# Altium schematic sheet 28 Core Pwr.SchDoc
size 420 x 297 mm
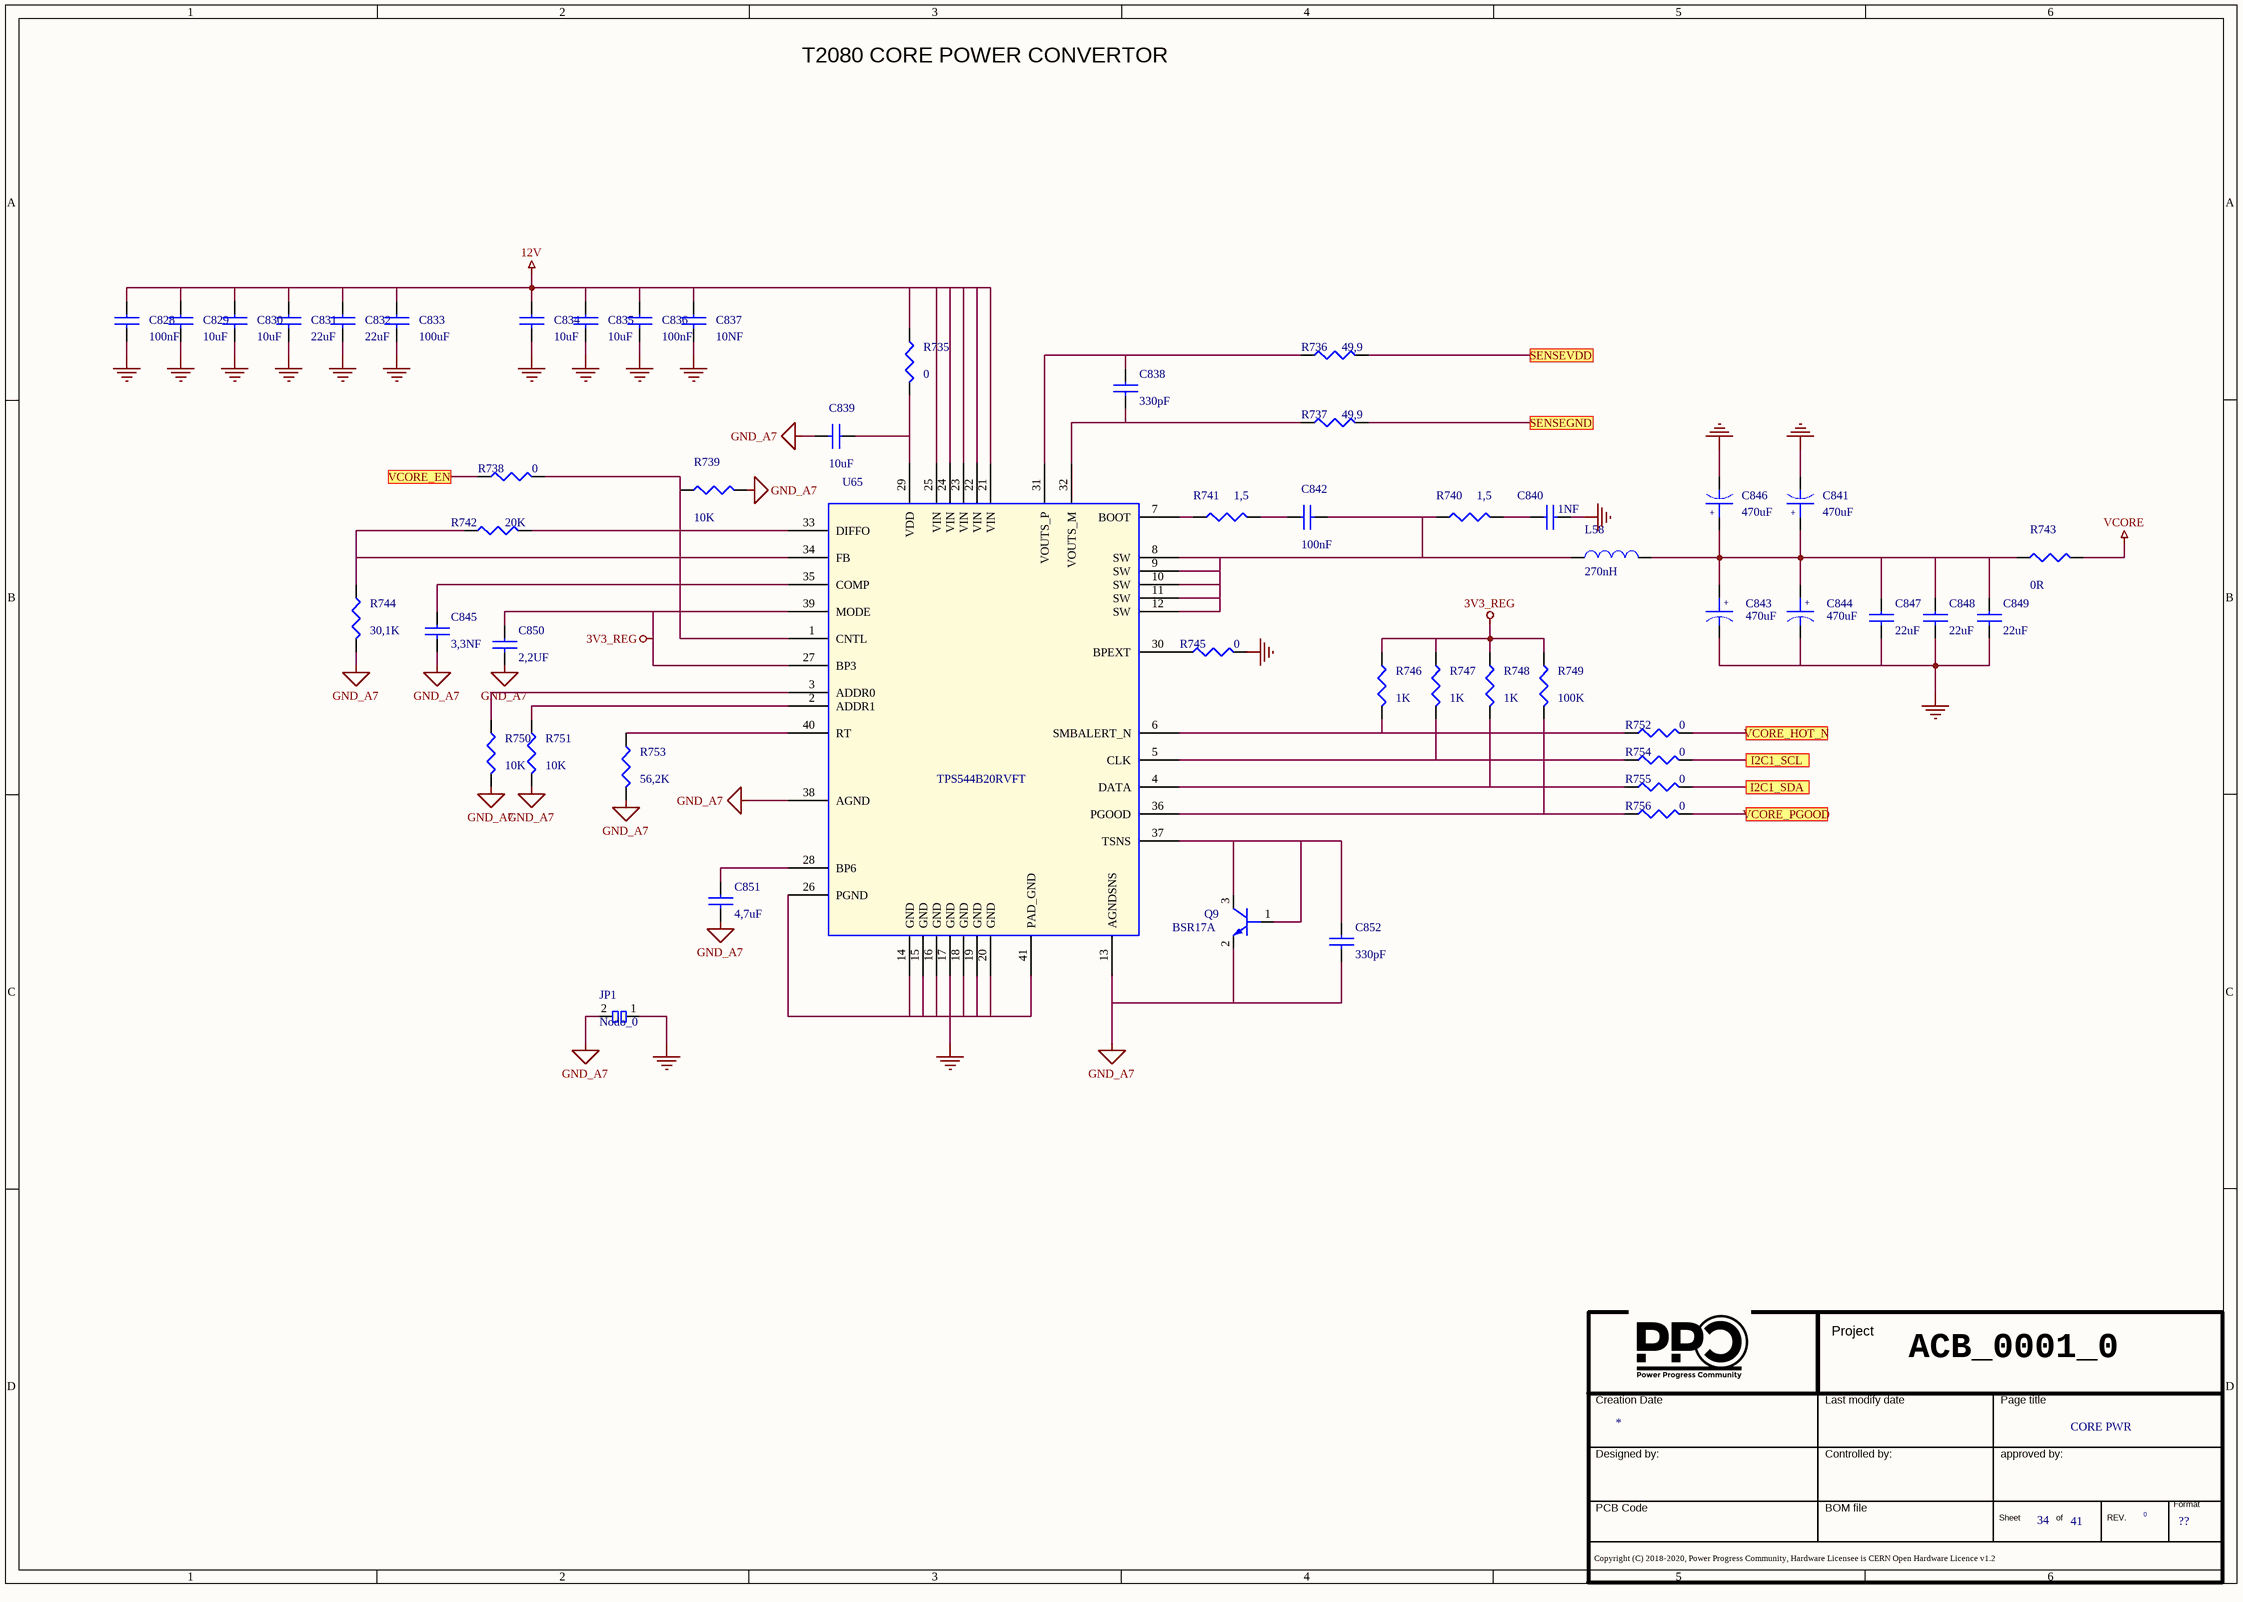
[diagram p0: 28 Core Pwr.SchDoc]

## Parts
*  Doc: CORE PWR  Page Count: 41  Page Number: 34  Page Size: ??  RevCode: 0  (hidden comment: Title_block_PPC)  (graphical)
C828  100nF  [SMD_0402]
C829  10uF  [SMD_0603]
C830  10uF  [SMD_0603]
C831  22uF  [SMD_0805]
C832  22uF  [SMD_0805]
C833  100uF  [SMD_1210]
C834  10uF  [SMD_0603]
C835  10uF  [SMD_0603]
C836  100nF  [SMD_0402]
C837  10NF  [SMD_0402]
C838  330pF  [SMD_0402]
C839  10uF  [SMD_0603]
C840  1NF  [SMD_0402]
C841  470uF  [SMD_CASE_GX]
C842  100nF  [SMD_0402]
C843  470uF  [SMD_CASE_GX]
C844  470uF  [SMD_CASE_GX]
C845  3,3NF  [SMD_0402]
C846  470uF  [SMD_CASE_GX]
C847  22uF  [SMD_1206]
C848  22uF  [SMD_1206]
C849  22uF  [SMD_1206]
C850  2,2UF  [SMD_0402]
C851  4,7uF  [SMD_0402]
C852  330pF  [SMD_0402]
JP1  Nodo_0
L58  270nH  [SMD_7_65X11mm]
Q9  BSR17A  [SOT_23]
R735  0  [SMD_1206]
R736  49,9  [SMD_0402]
R737  49,9  [SMD_0402]
R738  0  [SMD_0402]
R739  10K  [SMD_0402]
R740  1,5  [SMD_0402]
R741  1,5  [SMD_0402]
R742  20K  [SMD_0402]
R743  0R  [SMD_2010]
R744  30,1K  [SMD_0402]
R745  0  [SMD_0402]
R746  1K  [SMD_0402]
R747  1K  [SMD_0402]
R748  1K  [SMD_0402]
R749  100K  [SMD_0402]
R750  10K  [SMD_0402]
R751  10K  [SMD_0402]
R752  0  [SMD_0402]
R753  56,2K  [SMD_0402]
R754  0  [SMD_0402]
R755  0  [SMD_0402]
R756  0  [SMD_0402]
U65  TPS544B20RVFT  [LQFN40]

## Ports
I2C1_SCL, I2C1_SDA, SENSEGND, SENSEVDD, VCORE_EN, VCORE_HOT_N, VCORE_PGOOD

## Nets
3V3_REG: C850.1 R746.1 R747.1 R748.1 R749.1 U65.27(BP3) U65.39(MODE)
12V: C828.1 C829.1 C830.1 C831.1 C832.1 C833.1 C834.1 C835.1 C836.1 C837.1 R735.1 U65.21(VIN) U65.22(VIN) U65.23(VIN) U65.24(VIN) U65.25(VIN)
GND: C828.2 C829.2 C830.2 C831.2 C832.2 C833.2 C834.2 C835.2 C836.2 C837.2 C840.2 C841.2 C843.2 C844.2 C846.2 C847.2 C848.2 C849.2 JP1.1 R745.2 U65.14(GND) U65.15(GND) U65.16(GND) U65.17(GND) U65.18(GND) U65.19(GND) U65.20(GND) U65.26(PGND) U65.41(PAD_GND)
GND_A7: C839.2 C845.2 C850.2 C851.2 C852.2 JP1.2 Q9.2(E) R739.2 R744.2 R750.2 R751.2 R753.2 U65.13(AGNDSNS) U65.38(AGND)
VCORE: R743.2
I2C1_SCL: R754.2 ; port I2C1_SCL
I2C1_SDA: R755.2 ; port I2C1_SDA
SENSEGND: R737.2 ; port SENSEGND
SENSEVDD: R736.2 ; port SENSEVDD
VCORE_EN: R738.1 ; port VCORE_EN
VCORE_HOT_N: R752.2 ; port VCORE_HOT_N
VCORE_PGOOD: R756.2 ; port VCORE_PGOOD
NetC838_1: C838.1 R736.1 U65.31(VOUTS_P)
NetC838_2: C838.2 R737.1 U65.32(VOUTS_M)
NetC839_1: C839.1 R735.2 U65.29(VDD)
NetC840_1: C840.1 R740.2
NetC841_1: C841.1 C843.1 C844.1 C846.1 C847.1 C848.1 C849.1 L58.2 R743.1
NetC842_1: C842.1 R741.2
NetC842_2: C842.2 L58.1 R740.1 U65.8(SW) U65.9(SW) U65.10(SW) U65.11(SW) U65.12(SW)
NetC845_1: C845.1 U65.35(COMP)
NetC851_1: C851.1 U65.28(BP6)
NetC852_1: C852.1 Q9.1(B) Q9.3(C) U65.37(TSNS)
NetR738_2: R738.2 R739.1 U65.1(CNTL)
NetR741_1: R741.1 U65.7(BOOT)
NetR742_1: R742.1 R744.1 U65.34(FB)
NetR742_2: R742.2 U65.33(DIFFO)
NetR745_1: R745.1 U65.30(BPEXT)
NetR746_2: R746.2 R752.1 U65.6(SMBALERT_N)
NetR747_2: R747.2 R754.1 U65.5(CLK)
NetR748_2: R748.2 R755.1 U65.4(DATA)
NetR749_2: R749.2 R756.1 U65.36(PGOOD)
NetR750_1: R750.1 U65.3(ADDR0)
NetR751_1: R751.1 U65.2(ADDR1)
NetR753_1: R753.1 U65.40(RT)

## Notes on the sheet
- T2080 CORE POWER CONVERTOR
- ACB_0001_0
- (in symbol CAP POL) +
- (in symbol Title_block_PPC) Project; Creation Date; Last modify date; Page title; Designed by:; Controlled by:; approved by:; Format; PCB Code; BOM file; Sheet; of; REV.; Copyright (C) 2018-2020, Power Progress Community, Hardware Licensee is CERN Open Hardware Licence v1.2

## Library data of the parts
* = Title_block_PPC: Title: T2080PCIe; Schematic Page Count: 45; Schematic Page Number: 37; Author: MICETEK; Page Create Date: March  8, 1995; Page Title: ?; Page Modify Date: *
C828 C836 = CAP NP_Dup2: COND.CER. 100NF 50V 0402 X7R SMD; Manufacturer Part Number 1: CGA2B3X7R1H104M050BD; Manufacturer 1: TDK; Part Number: PASSIVE_24; RSM: RC0402; PCB Footprint: SMD_0402; Part Type: Capacitors\Ceramic\SMD\0402
C829 C830 C834 C835 C839 = CAP NP_Dup2: COND.CER.10uF 0603 25V SMD; Part Number: PASSIVE_124; Manufacturer 1: SAMSUNG; Manufacturer Part Number 1: CL10A106MA8NRNC; RSM: RC0603; PCB Footprint: SMD_0603; Part Type: Capacitors\Ceramic\SMD\0603
C831 C832 = CAP NP_Dup2: 22UF 35V 20% 0805; Part Number: PASSIVE_224; Manufacturer 1: TDK; Manufacturer Part Number 1: C2012X5R1V226M125AC; RSM: RC0805; PCB Footprint: SMD_0805; Part Type: Capacitors\Ceramic\SMD\0805
C833 = CAP NP_Dup2: CAP CER 100UF 16V 20% X5R 1210; Part Number: PASSIVE_264; Manufacturer 1: Taiyo Yuden; Manufacturer Part Number 1: EMK325ABJ107MM-T; RSM: RC1210; PCB Footprint: SMD_1210; Part Type: Capacitors\Ceramic\SMD\1210
C837 = CAP NP_Dup2: COND.CER. 10NF 16V 0402 X7R SMD; Manufacturer Part Number 1: 0402YC103KAT2A; Manufacturer 1: AVX; Part Number: PASSIVE_28; RSM: RC0402; PCB Footprint: SMD_0402; Part Type: Capacitors\Ceramic\SMD\0402
C838 C852 = CAP NP_Dup2: CAP CER 330PF 50V 5% C0G 0402 HiRel; Manufacturer Part Number 1: CGJ2B2C0G1H331J050BA; Manufacturer 1: TDK; Part Number: PASSIVE_73; RSM: RC0402; PCB Footprint: SMD_0402; Part Type: Capacitors\Ceramic\SMD\0402
C840 = CAP NP_Dup2: COND.CER. 1NF 50V 0402 X7R SMD; Manufacturer Part Number 1: GRM15XR71H102KA86D; Manufacturer 1: Murata; Part Number: PASSIVE_47; RSM: RC0402; PCB Footprint: SMD_0402; Part Type: Capacitors\Ceramic\SMD\0402
C841 C846 = CAP POL: COND.TANT. 470uF 2v CASE-GX SMD; Part Number: PASSIVE_1473; Manufacturer 1: PANASONIC; Manufacturer Part Number 1: EEF-GX0D471R; RSM: TANT-D; PCB Footprint: SMD_CASE_GX; Part Type: Capacitors\Tantalum\SMD\CASE_GX
C842 = CAP NP_Dup2: COND.CER. 100NF 50V 0402 X7R SMD; Part Number: PASSIVE_24; Manufacturer 1: TDK; Manufacturer Part Number 1: CGA2B3X7R1H104M050BD; RSM: RC0402; PCB Footprint: SMD_0402; Part Type: Capacitors\Ceramic\SMD\0402
C843 C844 = CAP POL: COND.TANT. 470uF 2v CASE-GX SMD; Manufacturer Part Number 1: EEF-GX0D471R; Manufacturer 1: PANASONIC; Part Number: PASSIVE_1473; RSM: TANT-D; PCB Footprint: SMD_CASE_GX; Part Type: Capacitors\Tantalum\SMD\CASE_GX
C845 = CAP NP_Dup2: COND.CER. 3,3NF 50V 0402 X7R SMD; Part Number: PASSIVE_69; RSM: RC0402; PCB Footprint: SMD_0402; Part Type: Capacitors\Ceramic\SMD\0402
C847-C849 = CAP NP_Dup2: CAP CER 22UF 16V 10% X5R 1206; Manufacturer Part Number 1: CL31A226KOHNNNE; Manufacturer 1: SAMSUNG; Part Number: PASSIVE_258; RSM: RC1206; PCB Footprint: SMD_1206; Part Type: Capacitors\Ceramic\SMD\1206
C850 = CAP NP_Dup2: CAP CER 2.2UF 25V X5R 0402; Manufacturer Part Number 1: GRM155R61E225ME15D; Manufacturer 1: Murata; Part Number: PASSIVE_1411; RSM: RC0402; PCB Footprint: SMD_0402; Part Type: Capacitors\Ceramic\SMD\0402
C851 = CAP NP_Dup2: CAP CER 4.7UF 10V 20% X5R 0402; Part Number: PASSIVE_80; Manufacturer 1: TDK; Manufacturer Part Number 1: C1005X5R1A475M050BC; RSM: RC0402; PCB Footprint: SMD_0402; Part Type: Capacitors\Ceramic\SMD\0402
JP1 = JUMPER_0: Serve solo al masterista per collegare i gnd; LNK_PART: SEZ0201_CHIUSO; Part Number: DA CODIFICARE; TECNO77: NODO; Part Type: NODO; RSM: NODO
L58 = INDUCTOR_Dup1: Induttori fissi 270nH Shld 20% 35.5A 228mOhms; Manufacturer Part Number 1: SLC1175-271MEB; Manufacturer 1: Coilcraft; Part Number: PASSIVE_1472; RSM: IND-BOURNS-SLC1175; PCB Footprint: SMD_7_65X11mm; Part Type: Inductors\SMD
Q9 = NPN BEC: TRANS NPN 40V 0.2A SOT-23; Manufacturer 1: ON Semi; Part Number: DISCRETE_327; PCB Footprint: SOT_23; Distributor 1: DIGIKEY ( / DIGIKEY(BSR17ATR-ND); Manufacturer Part Number 1: BSR17A; Part Type: Transistors\Bipolar\NPN; RSM: SOT-23
R735 = R_Dup5: RESIS. 0R 1/4W 1206 SMD E96; Manufacturer Part Number 1: RC1206JR-070RL; Manufacturer 1: YAGEO; Part Number: PASSIVE_1266; RSM: RC1206; PCB Footprint: SMD_1206; Part Type: Resistors\Fixed\SMD\1206\5%
R736 R737 = R_Dup5: RESIS.CHIP 49,9R 1% 0402 SMD; Part Number: PASSIVE_738; Manufacturer 1: NIC; Manufacturer Part Number 1: NCR04F49R9TRF; RSM: RC0402; PCB Footprint: SMD_0402; Part Type: Resistors\Fixed\SMD\0402\1%
R738 R745 R752 R754-R756 = R_Dup5: RESIS.CHIP 0R 5% 0402 SMD; Part Number: PASSIVE_805; Manufacturer 1: ROYAL OHM; RSM: RC0402; PCB Footprint: SMD_0402; Part Type: Resistors\Fixed\SMD\0402\5%; Manufacturer Part Number 1: RESIS.CHIP 0R 5% 0402 SMD
R739 R750 R751 = R_Dup5: RESIS.CHIP 10K 5% 0402 SMD; Part Number: PASSIVE_814; Manufacturer 1: ROYAL OHM; RSM: RC0402; PCB Footprint: SMD_0402; Part Type: Resistors\Fixed\SMD\0402\5%; Manufacturer Part Number 1: RESIS.CHIP 10K 5% 0402 SMD
R740 R741 = R_Dup5: RESIS.CHIP 1,5OHM 1% 0402 SMD; Part Number: PASSIVE_573; Manufacturer 1: WELWYN; Manufacturer Part Number 1: ASC0402-1R5FT10; RSM: RC0402; PCB Footprint: SMD_0402; Part Type: Resistors\Fixed\SMD\0402\1%
R742 = R_Dup5: RESIS.CHIP 20K 1% 0402 SMD; Manufacturer Part Number 1: RC0402FR-1320KL; Manufacturer 1: YAGEO; Part Number: PASSIVE_641; RSM: RC0402; PCB Footprint: SMD_0402; Part Type: Resistors\Fixed\SMD\0402\1%
R743 = R_Dup5: RESIS. CHIP 0R 1/4W 1% 2010 SMD; Part Number: PASSIVE_1310; Manufacturer 1: Vishay; Manufacturer Part Number 1: CRCW20100000Z0EF; RSM: RC2010; PCB Footprint: SMD_2010; Part Type: Resistors\Fixed\SMD\2010\1%
R744 = R_Dup5: RESIS.CHIP 30K1 1% 0402 SMD; Manufacturer 1: ROYAL OHM; Part Number: PASSIVE_683; RSM: RC0402; PCB Footprint: SMD_0402; Manufacturer Part Number 1: RESIS.CHIP 30K1 1% 0402 SMD; Part Type: Resistors\Fixed\SMD\0402\1%
R746 = R_Dup5: RESIS.CHIP 1K 5% 0402 SMD; Manufacturer 1: ROYAL OHM; Part Number: PASSIVE_832; RSM: RC0402; PCB Footprint: SMD_0402; Manufacturer Part Number 1: RESIS.CHIP 1K 5% 0402 SMD; Part Type: Resistors\Fixed\SMD\0402\5%
R747 R748 = R_Dup5: RESIS.CHIP 1K 5% 0402 SMD; Part Number: PASSIVE_832; Manufacturer 1: ROYAL OHM; RSM: RC0402; PCB Footprint: SMD_0402; Part Type: Resistors\Fixed\SMD\0402\5%; Manufacturer Part Number 1: RESIS.CHIP 1K 5% 0402 SMD
R749 = R_Dup5: RESIS.CHIP 100K 5% 0402 SMD; Part Number: PASSIVE_813; Manufacturer 1: ROYAL OHM; RSM: RC0402; PCB Footprint: SMD_0402; Part Type: Resistors\Fixed\SMD\0402\5%; Manufacturer Part Number 1: RESIS.CHIP 100K 5% 0402 SMD
R753 = R_Dup5: RESIS.CHIP 56,2K 1% 0402 SMD; Manufacturer 1: ROYAL OHM; Part Number: PASSIVE_755; RSM: RC0402; PCB Footprint: SMD_0402; Manufacturer Part Number 1: RESIS.CHIP 56,2K 1% 0402 SMD; Part Type: Resistors\Fixed\SMD\0402\1%
U65 = TPS544X20: IC REG BUCK ADJ 20A 40LQFN; Part Number: LINEAR_334; Manufacturer 1: TEXAS; RSM: LQFN-40-EP-7_1X5_1; PCB Footprint: LQFN40; Part Type: Regulators\Switching; Manufacturer Part Number 1: TPS544B20RVFT; Distributor 1: DIGIKEY(296-37876-1-ND)